# EAGLE design ArduinoCape (EAGLE 8.2.0)
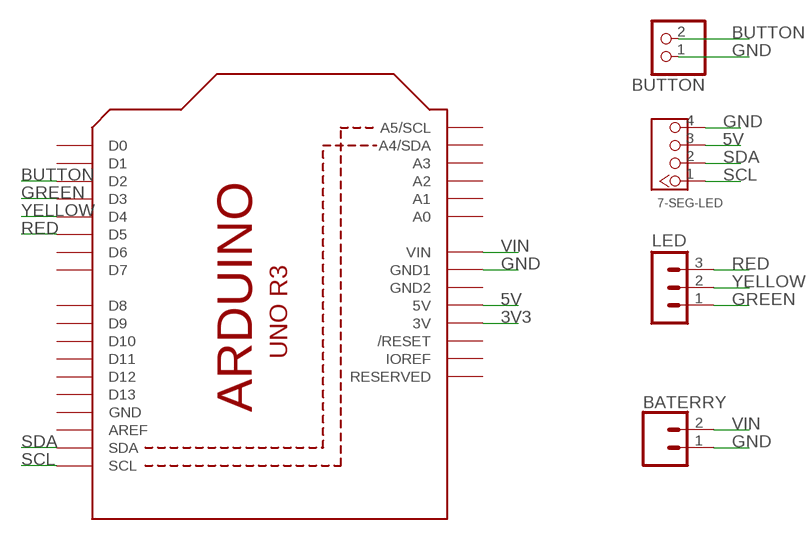
[diagram p0: schematic, sheet 1]

## Parts
7-SEG-LED  GROVE-CONNECTOR-DIP(4P-2.0)  [HW4-2.0]
BATERRY  CONN_02JST-PTH-2  [JST-2-PTH]
BUTTON  PINHD-1X2  [1X02]
LED  MA03-1  [MA03-1]
U1  ARDUINOR3-DIMENSION  [ARDUINOR3]

## Nets
3V3: U1.3V
5V: 7-SEG-LED.3 U1.5V
BUTTON: BUTTON.2 U1.D2
GND: 7-SEG-LED.4 BATERRY.1 BUTTON.1 U1.GND1
GREEN: LED.1 U1.D3
RED: LED.3 U1.D5
SCL: 7-SEG-LED.1 U1.SCL
SDA: 7-SEG-LED.2 U1.SDA
VIN: BATERRY.2 U1.VIN
YELLOW: LED.2 U1.D4
Unconnected: U1.A0 U1.A1 U1.A2 U1.A3 U1.A4(A4/SDA) U1.A5(A5/SCL) U1.AREF U1.D0 U1.D1 U1.D6 U1.D7 U1.D8 U1.D9 U1.D10 U1.D11 U1.D12 U1.D13 U1.IOREF U1.RESERVED U1.RESET(/RESET)

## Power pins joined to a net without a drawn wire
GND: U1.GND
GND2: U1.GND2

## Library data of the parts
7-SEG-LED = Seeed-OPL-Connector:GROVE-CONNECTOR-DIP(4P-2.0): 320110033; VALUE: 4P-2.0
BATERRY = SparkFun-Connectors:CONN_02: Multi connection point. Often used as Generic Header-pin footprint for 0.1 inch spaced/style header connections On any of the 0.1 inch spaced packages, you can populate with these: Break Away Headers - Straight <https://www.sparkfun.com/products/116> (PRT-00116) Break Away Male Headers - Right Angle <https://www.sparkfun.com/products/553> (PRT-00553) Female Headers <https://www.sparkfun.com/products/115> (PRT-00115) Break Away Headers - Machine Pin <https://www.sparkfun.com/products/117> (PRT-00117) Break Away Female Headers - Swiss Machine Pin <https://www.sparkfun.com/products/743> (PRT-00743) For SCREWTERMINALS and SPRING TERMINALS visit here: Screw Terimnals on SparkFun.com <https://www.sparkfun.com/search/results?term=Screw+Terminals> (5mm/3.5mm/2.54mm spacing) This device is also useful as a general connection point to wire up your design to another part of your project. Our various solder wires solder well into these plated through hole pads. Hook-Up Wire - Assortment (Stranded, 22 AWG) <https://www.sparkfun.com/products/11375> (PRT-11375) Hook-Up Wire - Assortment (Solid Core, 22 AWG) <https://www.sparkfun.com/products/11367> (PRT-11367) View the entire wire category on our website here <https://www.sparkfun.com/categories/141> Special notes: Molex polarized connector foot print use with: PRT-08233 with associated crimp pins and housings. 2.54_SCREWTERM for use with PRT-10571. 3.5mm Screw Terminal footprints for PRT-08084 5mm Screw Terminal footprints for use with PRT-08432; PROD_ID: CONN-09863; SKU: PRT-09914
BUTTON = pinhead:PINHD-1X2: PIN HEADER
LED = con-lstb:MA03-1: PIN HEADER; OC_FARNELL: unknown; OC_NEWARK: unknown
U1 = adafruit:ARDUINOR3: This is a new object for the new Arduino R3 - with extra pins that you may want to use (such as IOref, and duplicated A4/A5

## Board
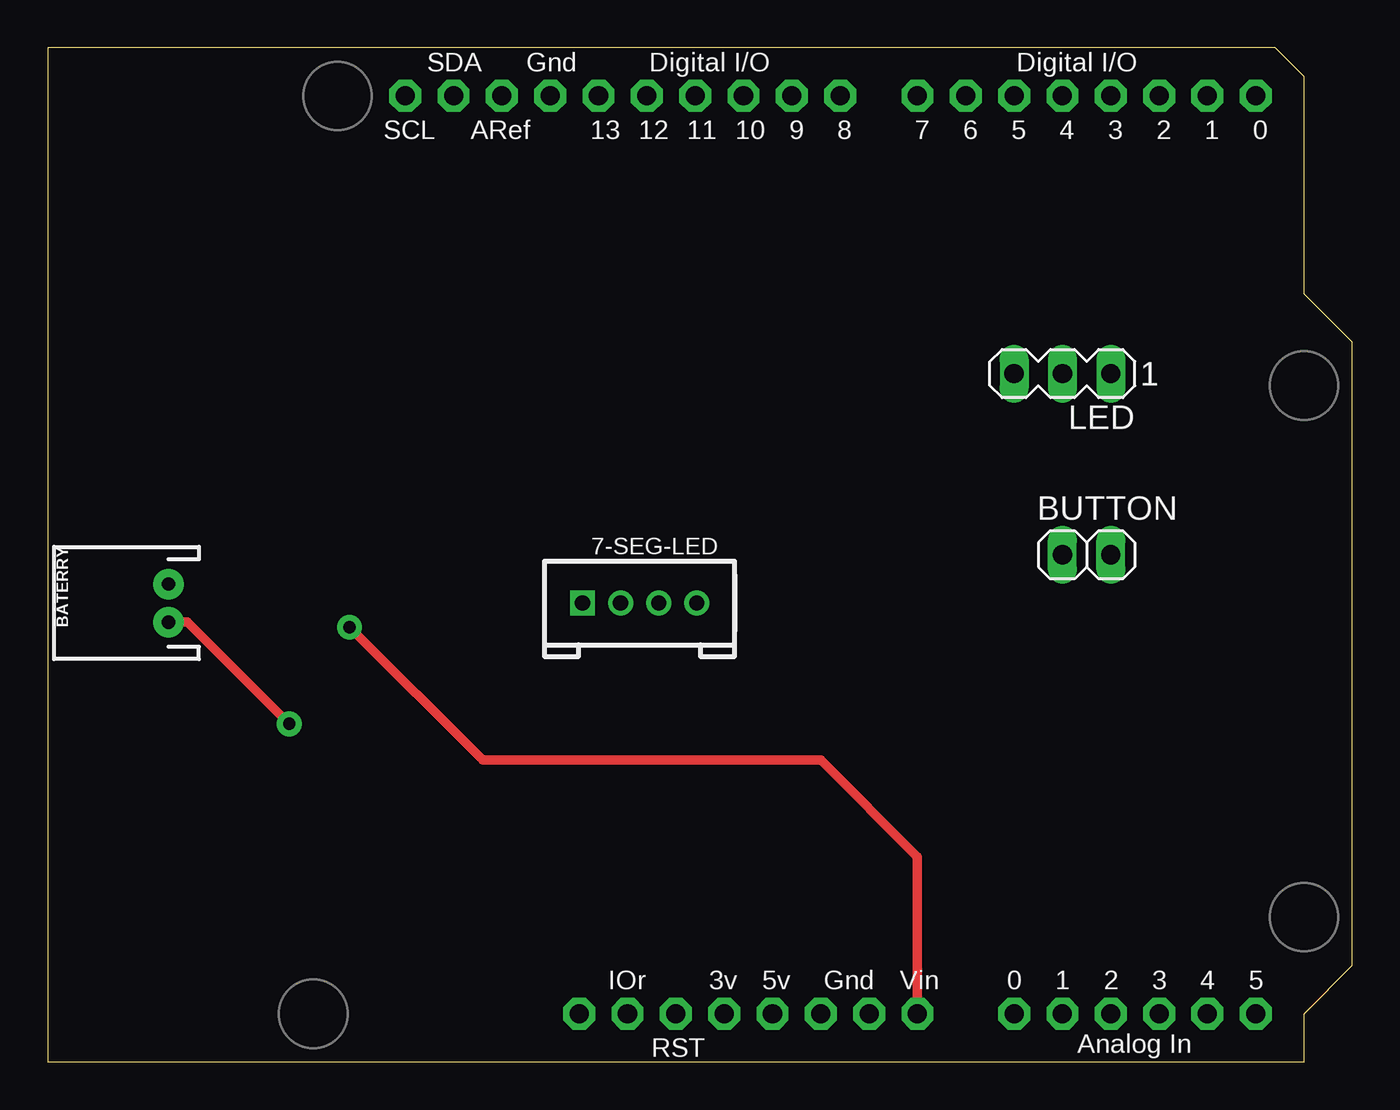
[diagram p1: board, top side]
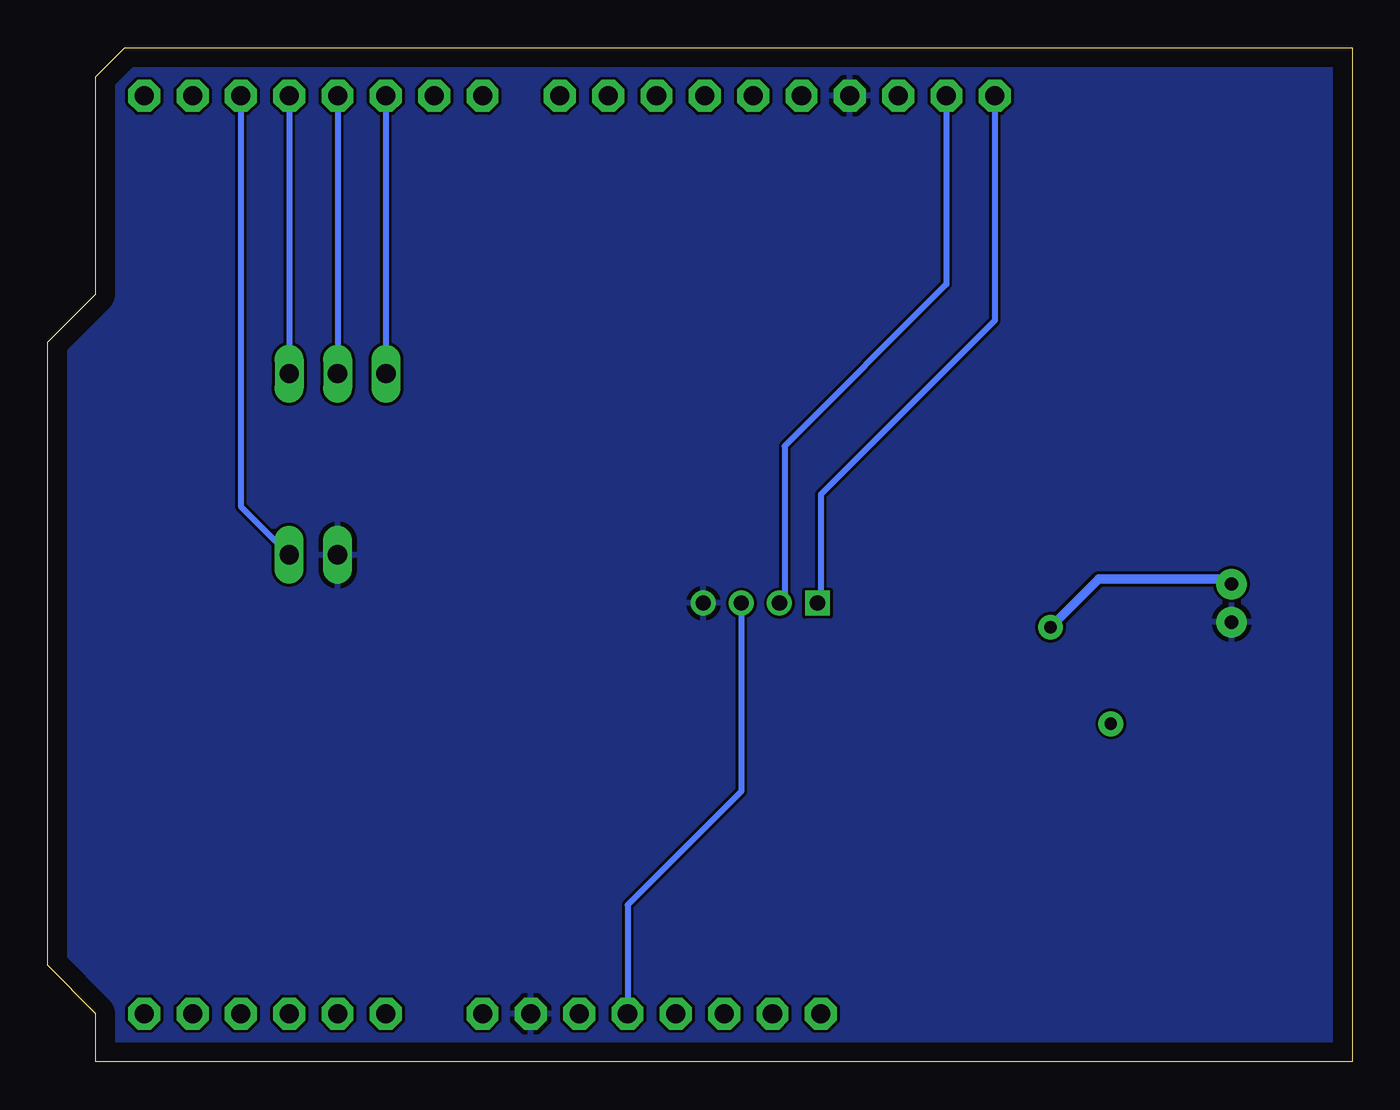
[diagram p2: board, bottom side, seen from below]

Size 68.58 x 53.34 mm. Coordinates in mm from the lower left corner, seen from the top.
Copper layers (1*16): Top 0.035mm / dielectric 1.5mm / Bottom 0.035mm
Design rules "default": minimum track width 6mil, minimum drill 0.35mm, track to track 6mil, track to pad 6mil, pad to pad 6mil, via to via 6mil, smd to smd 6mil, copper to edge 40mil, drill to drill 6mil, minimum pad ring 10mil, minimum via ring 8mil, stop-mask expansion 4mil, vias tented up to drill 0mil, thermal gap 10mil

### Footprints (pad centres in the part's own frame; a part is rotated, then mirrored left to right if it is on the bottom)
HW4-2.0 = drill 0.8 pad 1.27 square: 1 -3,0 | drill 0.8 pad 1.27: 2 -1,0; 3 1,0; 4 3,0
JST-2-PTH = drill 0.7 pad 1.6: 1 -1,0; 2 1,0
1X02 = drill 1.016 long: 1 -1.27,0; 2 1.27,0
MA03-1 = drill 1.016 long: 1 -2.54,0; 2 0,0; 3 2.54,0
ARDUINOR3 = drill 1 pad 1.676 octagon: 3V 35.56,2.54; 5V 38.1,2.54; A0 50.8,2.54; A1 53.34,2.54; A2 55.88,2.54; A3 58.42,2.54; A4 60.96,2.54; A5 63.5,2.54; AREF 23.876,50.8; D0 63.5,50.8; D1 60.96,50.8; D2 58.42,50.8; D3 55.88,50.8; D4 53.34,50.8; D5 50.8,50.8; D6 48.26,50.8; D7 45.72,50.8; D8 41.656,50.8; D9 39.116,50.8; D10 36.576,50.8; D11 34.036,50.8; D12 31.496,50.8; D13 28.956,50.8; GND 26.416,50.8; GND1 43.18,2.54; GND2 40.64,2.54; IOREF 30.48,2.54; RESERVED 27.94,2.54; RESET 33.02,2.54; SCL 18.796,50.8; SDA 21.336,50.8; VIN 45.72,2.54

### Placement (x,y rotation side)
7-SEG-LED  31.11,24.13 0 top
BATERRY  6.35,24.13 90 top
BUTTON  54.61,26.67 0 top
LED  53.34,36.2 180 top
U1  0,0 0 top

### Tracks (layer width: path | path; a pad name or v marks a point on that pad's centre or on a via)
5V
  Bottom 0.305: 7-SEG-LED.3 32.12,14.24 38.1,8.26 U1.5V
BUTTON
  Bottom 0.305: BUTTON.2 58.42,29.21 U1.D2
GND
  Top 0.508: BATERRY.1 7.35,23.13 12.7,17.78
  pour Bottom: -0.64,53.98 -0.64,-0.64 69.22,-0.64 69.22,53.98
GREEN
  Bottom 0.305: U1.D3 LED.1
N$1  (via drill 0.65 pad 1.3)
  other vias: 12.7,17.78
RED
  Bottom 0.305: U1.D5 LED.3
SCL
  Bottom 0.305: U1.SCL 18.8,38.99 27.94,29.84 27.94,24.3 7-SEG-LED.1
SDA
  Bottom 0.305: U1.SDA 21.34,40.89 29.84,32.38 29.84,24.4 7-SEG-LED.2
VIN  (via drill 0.65 pad 1.3)
  Top 0.508: U1.VIN 45.72,10.79 40.64,15.88 22.86,15.88 v15.88,22.86
  Bottom 0.508: v15.88,22.86 13.34,25.4 6.62,25.4 BATERRY.2
YELLOW
  Bottom 0.305: U1.D4 LED.2